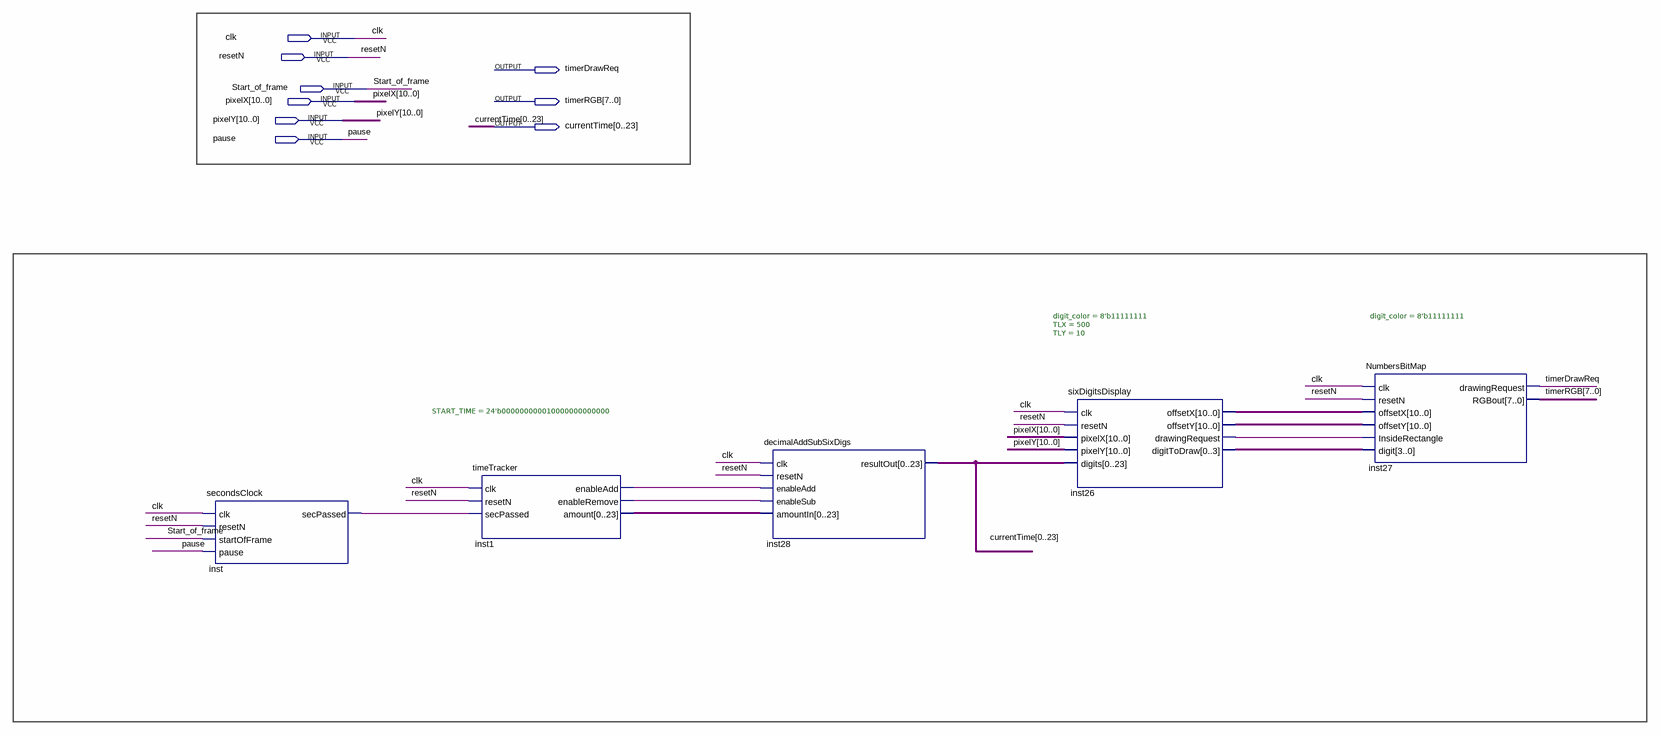
[diagram p0: schematic sheet]
// Quartus schematic TOP_TIMER.bdf as structural Verilog: 5 symbols, 9 pins
module TOP_TIMER (
  input  clk,
  input  resetN,
  input  Start_of_frame,
  input  [10:0] pixelX,
  input  [10:0] pixelY,
  input  pause,
  output timerDrawReq,
  output [7:0] timerRGB,
  output [0:23] currentTime
);

  wire inst1_enableadd, inst1_enableremove, inst26_drawingrequest, inst_secpassed;
  wire [3:0] inst26_digittodraw;
  wire [10:0] inst26_offsetx, inst26_offsety;
  wire [23:0] inst1_amount;

  secondsClock inst (
    .clk(clk), .resetN(resetN), .startOfFrame(Start_of_frame), .pause(pause), .secPassed(inst_secpassed));
  timeTracker #(.START_TIME(24'b000000000010000000000000)) inst1 (
    .clk(clk), .resetN(resetN), .secPassed(inst_secpassed), .enableAdd(inst1_enableadd),
    .enableRemove(inst1_enableremove), .amount(inst1_amount));
  decimalAddSubSixDigs inst28 (
    .clk(clk), .resetN(resetN), .enableAdd(inst1_enableadd), .enableSub(inst1_enableremove),
    .amountIn(inst1_amount), .resultOut(currentTime));
  sixDigitsDisplay #(.digit_color(8'b11111111), .TLX(500), .TLY(10)) inst26 (
    .clk(clk), .resetN(resetN), .pixelX(pixelX), .pixelY(pixelY), .digits(currentTime),
    .offsetX(inst26_offsetx), .offsetY(inst26_offsety), .drawingRequest(inst26_drawingrequest),
    .digitToDraw(inst26_digittodraw));
  NumbersBitMap #(.digit_color(8'b11111111)) inst27 (
    .clk(clk), .resetN(resetN), .offsetX(inst26_offsetx), .offsetY(inst26_offsety),
    .InsideRectangle(inst26_drawingrequest), .digit(inst26_digittodraw), .drawingRequest(timerDrawReq),
    .RGBout(timerRGB));
endmodule
